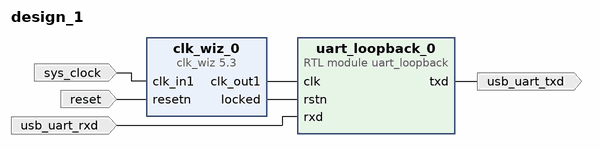
[diagram p0: block diagram of the top level]
# Vivado block design design_1, xc7a35ticsg324-1L, Vivado 2016.4
create_bd_design design_1

create_bd_port -dir I -type clk sys_clock
set_property -dict {CONFIG.FREQ_HZ 100000000 CONFIG.PHASE 0.000} [get_bd_ports sys_clock]
create_bd_port -dir I -type rst reset
set_property -dict {CONFIG.POLARITY ACTIVE_LOW} [get_bd_ports reset]
create_bd_port -dir I -type data usb_uart_rxd
create_bd_port -dir O -type data usb_uart_txd

create_bd_cell -type ip -vlnv xilinx.com:ip:clk_wiz:5.3 clk_wiz_0
set_property -dict [list \
  CONFIG.RESET_PORT resetn \
  CONFIG.RESET_TYPE ACTIVE_LOW \
  CONFIG.USE_BOARD_FLOW true \
  CONFIG.CLK_IN1_BOARD_INTERFACE sys_clock \
  CONFIG.RESET_BOARD_INTERFACE reset \
] [get_bd_cells clk_wiz_0]
create_bd_cell -type module -reference uart_loopback uart_loopback_0

# ---- connections ----

connect_bd_net [get_bd_ports sys_clock] [get_bd_pins clk_wiz_0/clk_in1]
connect_bd_net [get_bd_ports reset] [get_bd_pins clk_wiz_0/resetn]
connect_bd_net [get_bd_ports usb_uart_rxd] [get_bd_pins uart_loopback_0/rxd]
connect_bd_net [get_bd_pins clk_wiz_0/clk_out1] [get_bd_pins uart_loopback_0/clk]
connect_bd_net [get_bd_pins clk_wiz_0/locked] [get_bd_pins uart_loopback_0/rstn]
connect_bd_net [get_bd_pins uart_loopback_0/txd] [get_bd_ports usb_uart_txd]

validate_bd_design
save_bd_design
